# EAGLE design NeuroDAC_Output_v1 (EAGLE 8.1.0)
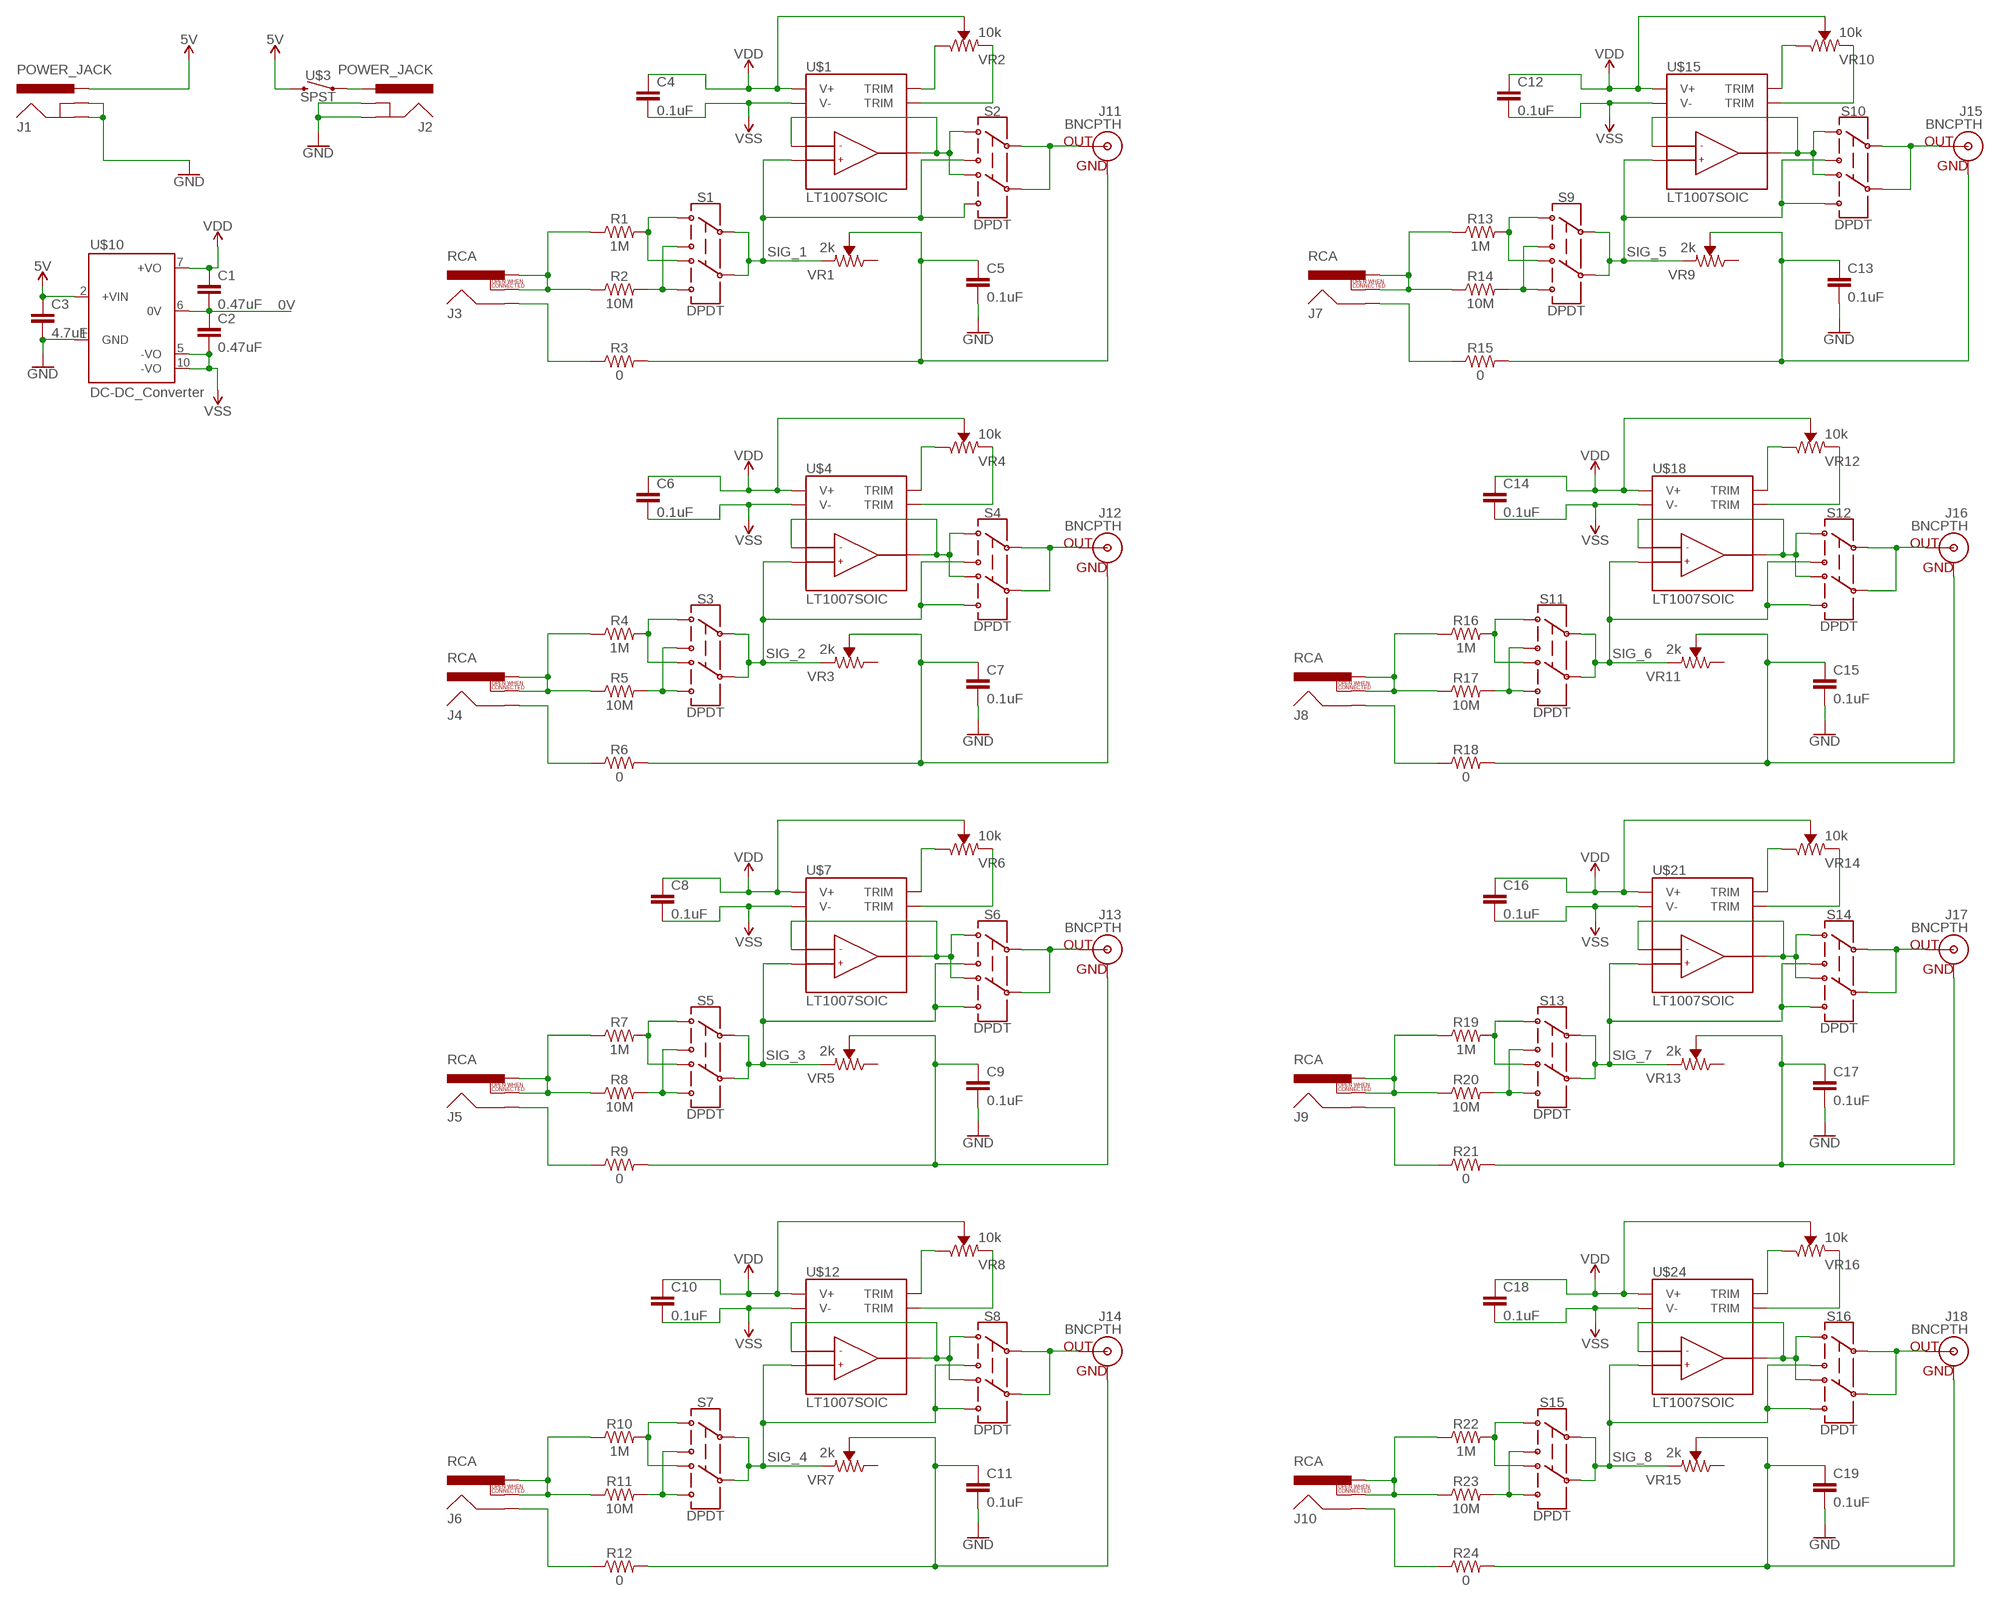
[diagram p0: schematic, sheet 1]

## Parts
C1  0.47uF  470NF-0603-25V-5%  [0603]
C2  0.47uF  470NF-0603-25V-5%  [0603]
C3  4.7uF  4.7UF-0805-25V-10%  [0805]
C4  0.1uF  0.1UF-0603-25V-5%  [0603]
C5  0.1uF  0.1UF-0603-25V-5%  [0603]
C6  0.1uF  0.1UF-0603-25V-5%  [0603]
C7  0.1uF  0.1UF-0603-25V-5%  [0603]
C8  0.1uF  0.1UF-0603-25V-5%  [0603]
C9  0.1uF  0.1UF-0603-25V-5%  [0603]
C10  0.1uF  0.1UF-0603-25V-5%  [0603]
C11  0.1uF  0.1UF-0603-25V-5%  [0603]
C12  0.1uF  0.1UF-0603-25V-5%  [0603]
C13  0.1uF  0.1UF-0603-25V-5%  [0603]
C14  0.1uF  0.1UF-0603-25V-5%  [0603]
C15  0.1uF  0.1UF-0603-25V-5%  [0603]
C16  0.1uF  0.1UF-0603-25V-5%  [0603]
C17  0.1uF  0.1UF-0603-25V-5%  [0603]
C18  0.1uF  0.1UF-0603-25V-5%  [0603]
C19  0.1uF  0.1UF-0603-25V-5%  [0603]
J1  POWER_JACK  [POWER_JACK_PTH]
J2  POWER_JACK  [POWER_JACK_PTH]
J3  RCA  RCASWITCHCRAFT_LARGEHOLE  [RCA_LARGE_HOLE]
J4  RCA  RCASWITCHCRAFT_LARGEHOLE  [RCA_LARGE_HOLE]
J5  RCA  RCASWITCHCRAFT_LARGEHOLE  [RCA_LARGE_HOLE]
J6  RCA  RCASWITCHCRAFT_LARGEHOLE  [RCA_LARGE_HOLE]
J7  RCA  RCASWITCHCRAFT_LARGEHOLE  [RCA_LARGE_HOLE]
J8  RCA  RCASWITCHCRAFT_LARGEHOLE  [RCA_LARGE_HOLE]
J9  RCA  RCASWITCHCRAFT_LARGEHOLE  [RCA_LARGE_HOLE]
J10  RCA  RCASWITCHCRAFT_LARGEHOLE  [RCA_LARGE_HOLE]
J11  BNCPTH  [BNC]
J12  BNCPTH  [BNC]
J13  BNCPTH  [BNC]
J14  BNCPTH  [BNC]
J15  BNCPTH  [BNC]
J16  BNCPTH  [BNC]
J17  BNCPTH  [BNC]
J18  BNCPTH  [BNC]
R1  1M  1MOHM-0603-1/4W-1%  [0603]
R2  10M  10MOHM-0603-1/4W-1%  [0603]
R3  0  0OHM-0603-1/4W  [0603]
R4  1M  1MOHM-0603-1/4W-1%  [0603]
R5  10M  10MOHM-0603-1/4W-1%  [0603]
R6  0  0OHM-0603-1/4W  [0603]
R7  1M  1MOHM-0603-1/4W-1%  [0603]
R8  10M  10MOHM-0603-1/4W-1%  [0603]
R9  0  0OHM-0603-1/4W  [0603]
R10  1M  1MOHM-0603-1/4W-1%  [0603]
R11  10M  10MOHM-0603-1/4W-1%  [0603]
R12  0  0OHM-0603-1/4W  [0603]
R13  1M  1MOHM-0603-1/4W-1%  [0603]
R14  10M  10MOHM-0603-1/4W-1%  [0603]
R15  0  0OHM-0603-1/4W  [0603]
R16  1M  1MOHM-0603-1/4W-1%  [0603]
R17  10M  10MOHM-0603-1/4W-1%  [0603]
R18  0  0OHM-0603-1/4W  [0603]
R19  1M  1MOHM-0603-1/4W-1%  [0603]
R20  10M  10MOHM-0603-1/4W-1%  [0603]
R21  0  0OHM-0603-1/4W  [0603]
R22  1M  1MOHM-0603-1/4W-1%  [0603]
R23  10M  10MOHM-0603-1/4W-1%  [0603]
R24  0  0OHM-0603-1/4W  [0603]
S1  DPDT  SWITCH-DPDT-SMD-JS202011SCQN  [SWITCH_DPDT_JS202011SCQN]
S2  DPDT  SWITCH-DPDT-SMD-JS202011SCQN  [SWITCH_DPDT_JS202011SCQN]
S3  DPDT  SWITCH-DPDT-SMD-JS202011SCQN  [SWITCH_DPDT_JS202011SCQN]
S4  DPDT  SWITCH-DPDT-SMD-JS202011SCQN  [SWITCH_DPDT_JS202011SCQN]
S5  DPDT  SWITCH-DPDT-SMD-JS202011SCQN  [SWITCH_DPDT_JS202011SCQN]
S6  DPDT  SWITCH-DPDT-SMD-JS202011SCQN  [SWITCH_DPDT_JS202011SCQN]
S7  DPDT  SWITCH-DPDT-SMD-JS202011SCQN  [SWITCH_DPDT_JS202011SCQN]
S8  DPDT  SWITCH-DPDT-SMD-JS202011SCQN  [SWITCH_DPDT_JS202011SCQN]
S9  DPDT  SWITCH-DPDT-SMD-JS202011SCQN  [SWITCH_DPDT_JS202011SCQN]
S10  DPDT  SWITCH-DPDT-SMD-JS202011SCQN  [SWITCH_DPDT_JS202011SCQN]
S11  DPDT  SWITCH-DPDT-SMD-JS202011SCQN  [SWITCH_DPDT_JS202011SCQN]
S12  DPDT  SWITCH-DPDT-SMD-JS202011SCQN  [SWITCH_DPDT_JS202011SCQN]
S13  DPDT  SWITCH-DPDT-SMD-JS202011SCQN  [SWITCH_DPDT_JS202011SCQN]
S14  DPDT  SWITCH-DPDT-SMD-JS202011SCQN  [SWITCH_DPDT_JS202011SCQN]
S15  DPDT  SWITCH-DPDT-SMD-JS202011SCQN  [SWITCH_DPDT_JS202011SCQN]
S16  DPDT  SWITCH-DPDT-SMD-JS202011SCQN  [SWITCH_DPDT_JS202011SCQN]
U$1  LT1007SOIC  [S8]
U$3  SPST  SWITCH-SPST-L101011MS02Q  [SWITCH_SPST_L101011MS02Q]
U$4  LT1007SOIC  [S8]
U$7  LT1007SOIC  [S8]
U$10  DC-DC_Converter  DC-DC-CONVERTER_DUALOUT-VAT2-S5-D15-SMT  [VAT2-SMT]
U$12  LT1007SOIC  [S8]
U$15  LT1007SOIC  [S8]
U$18  LT1007SOIC  [S8]
U$21  LT1007SOIC  [S8]
U$24  LT1007SOIC  [S8]
VR1  2k  TRIMPOT-SMD-ST-4EB  [TRIMPOT-SMD-ST4EB]
VR2  10k  TRIMPOT-SMD-ST-4EB  [TRIMPOT-SMD-ST4EB]
VR3  2k  TRIMPOT-SMD-ST-4EB  [TRIMPOT-SMD-ST4EB]
VR4  10k  TRIMPOT-SMD-ST-4EB  [TRIMPOT-SMD-ST4EB]
VR5  2k  TRIMPOT-SMD-ST-4EB  [TRIMPOT-SMD-ST4EB]
VR6  10k  TRIMPOT-SMD-ST-4EB  [TRIMPOT-SMD-ST4EB]
VR7  2k  TRIMPOT-SMD-ST-4EB  [TRIMPOT-SMD-ST4EB]
VR8  10k  TRIMPOT-SMD-ST-4EB  [TRIMPOT-SMD-ST4EB]
VR9  2k  TRIMPOT-SMD-ST-4EB  [TRIMPOT-SMD-ST4EB]
VR10  10k  TRIMPOT-SMD-ST-4EB  [TRIMPOT-SMD-ST4EB]
VR11  2k  TRIMPOT-SMD-ST-4EB  [TRIMPOT-SMD-ST4EB]
VR12  10k  TRIMPOT-SMD-ST-4EB  [TRIMPOT-SMD-ST4EB]
VR13  2k  TRIMPOT-SMD-ST-4EB  [TRIMPOT-SMD-ST4EB]
VR14  10k  TRIMPOT-SMD-ST-4EB  [TRIMPOT-SMD-ST4EB]
VR15  2k  TRIMPOT-SMD-ST-4EB  [TRIMPOT-SMD-ST4EB]
VR16  10k  TRIMPOT-SMD-ST-4EB  [TRIMPOT-SMD-ST4EB]

## Nets
0V: C1.2 C2.1 C5.1 C7.1 C9.1 C11.1 C13.1 C15.1 C17.1 C19.1 J11.GND J12.GND J13.GND J14.GND J15.GND J16.GND J17.GND J18.GND R3.2 R6.2 R9.2 R12.2 R15.2 R18.2 R21.2 R24.2 U$10.6(0V) VR1.2(WIPER) VR3.2(WIPER) VR5.2(WIPER) VR7.2(WIPER) VR9.2(WIPER) VR11.2(WIPER) VR13.2(WIPER) VR15.2(WIPER)
5V: C3.1 J1.PWR U$3.2 U$10.2(+VIN)
GND: C3.2 C5.2 C7.2 C9.2 C11.2 C13.2 C15.2 C17.2 C19.2 J1.GND J1.GNDBREAK J2.GND J2.GNDBREAK U$10.1(GND)
N$1: J3.PIN J3.SWITCH R1.1 R2.1
N$2: R1.2 S1.1 S1.4
N$3: J2.PWR U$3.1
N$4: R2.2 S1.3 S1.6
N$5: R4.2 S3.1 S3.4
N$6: J3.SHELL R3.1
N$7: U$1.1(TRIM) VR2.3(CW)
N$8: S2.1 S2.4 U$1.2(IN-) U$1.6(OUT)
N$9: U$1.8(TRIM) VR2.1(CCW)
N$10: J4.PIN J4.SWITCH R4.1 R5.1
N$11: R5.2 S3.3 S3.6
N$12: R7.2 S5.1 S5.4
N$13: R8.2 S5.3 S5.6
N$14: J4.SHELL R6.1
N$15: S4.1 S4.4 U$4.2(IN-) U$4.6(OUT)
N$16: U$4.1(TRIM) VR4.3(CW)
N$17: U$4.8(TRIM) VR4.1(CCW)
N$18: J5.PIN J5.SWITCH R7.1 R8.1
N$19: R10.2 S7.1 S7.4
N$20: R11.2 S7.3 S7.6
N$21: R13.2 S9.1 S9.4
N$22: J5.SHELL R9.1
N$23: S6.1 S6.4 U$7.2(IN-) U$7.6(OUT)
N$24: U$7.1(TRIM) VR6.3(CW)
N$25: U$7.8(TRIM) VR6.1(CCW)
N$26: J6.PIN J6.SWITCH R10.1 R11.1
N$27: R14.2 S9.3 S9.6
N$28: R16.2 S11.1 S11.4
N$29: R17.2 S11.3 S11.6
N$30: J6.SHELL R12.1
N$31: S8.1 S8.4 U$12.2(IN-) U$12.6(OUT)
N$32: U$12.1(TRIM) VR8.3(CW)
N$33: U$12.8(TRIM) VR8.1(CCW)
N$34: J7.PIN J7.SWITCH R13.1 R14.1
N$35: R19.2 S13.1 S13.4
N$36: R20.2 S13.3 S13.6
N$37: R22.2 S15.1 S15.4
N$38: J7.SHELL R15.1
N$39: S10.1 S10.4 U$15.2(IN-) U$15.6(OUT)
N$40: U$24.1(TRIM) VR16.3(CW)
N$41: U$15.8(TRIM) VR10.1(CCW)
N$42: J8.PIN J8.SWITCH R16.1 R17.1
N$43: R23.2 S15.3 S15.6
N$44: J11.S(OUT) S2.2 S2.5
N$45: J12.S(OUT) S4.2 S4.5
N$46: J8.SHELL R18.1
N$47: S12.1 S12.4 U$18.2(IN-) U$18.6(OUT)
N$48: U$21.1(TRIM) VR14.3(CW)
N$49: U$18.8(TRIM) VR12.1(CCW)
N$50: J9.PIN J9.SWITCH R19.1 R20.1
N$51: J13.S(OUT) S6.2 S6.5
N$52: J14.S(OUT) S8.2 S8.5
N$53: J15.S(OUT) S10.2 S10.5
N$54: J9.SHELL R21.1
N$55: S14.1 S14.4 U$21.2(IN-) U$21.6(OUT)
N$56: U$18.1(TRIM) VR12.3(CW)
N$57: U$21.8(TRIM) VR14.1(CCW)
N$58: J10.PIN J10.SWITCH R22.1 R23.1
N$59: J16.S(OUT) S12.2 S12.5
N$60: J17.S(OUT) S14.2 S14.5
N$61: J18.S(OUT) S16.2 S16.5
N$62: J10.SHELL R24.1
N$63: S16.1 S16.4 U$24.2(IN-) U$24.6(OUT)
N$64: U$15.1(TRIM) VR10.3(CW)
N$65: U$24.8(TRIM) VR16.1(CCW)
SIG_1: S1.2 S1.5 S2.3 S2.6 U$1.3(IN+) VR1.1(CCW)
SIG_2: S3.2 S3.5 S4.3 S4.6 U$4.3(IN+) VR3.1(CCW)
SIG_3: S5.2 S5.5 S6.3 S6.6 U$7.3(IN+) VR5.1(CCW)
SIG_4: S7.2 S7.5 S8.3 S8.6 U$12.3(IN+) VR7.1(CCW)
SIG_5: S9.2 S9.5 S10.3 S10.6 U$15.3(IN+) VR9.1(CCW)
SIG_6: S11.2 S11.5 S12.3 S12.6 U$18.3(IN+) VR11.1(CCW)
SIG_7: S13.2 S13.5 S14.3 S14.6 U$21.3(IN+) VR13.1(CCW)
SIG_8: S15.2 S15.5 S16.3 S16.6 U$24.3(IN+) VR15.1(CCW)
VDD: C1.1 C4.1 C6.1 C8.1 C10.1 C12.1 C14.1 C16.1 C18.1 U$1.7(V+) U$4.7(V+) U$7.7(V+) U$10.7(+VO) U$12.7(V+) U$15.7(V+) U$18.7(V+) U$21.7(V+) U$24.7(V+) VR2.2(WIPER) VR4.2(WIPER) VR6.2(WIPER) VR8.2(WIPER) VR10.2(WIPER) VR12.2(WIPER) VR14.2(WIPER) VR16.2(WIPER)
VSS: C2.2 C4.2 C6.2 C8.2 C10.2 C12.2 C14.2 C16.2 C18.2 U$1.4(V-) U$4.4(V-) U$7.4(V-) U$10.5(-VO) U$10.10(-VO) U$12.4(V-) U$15.4(V-) U$18.4(V-) U$21.4(V-) U$24.4(V-)
Unconnected: VR1.3(CW) VR3.3(CW) VR5.3(CW) VR7.3(CW) VR9.3(CW) VR11.3(CW) VR13.3(CW) VR15.3(CW)

## Library data of the parts
C1 C2 = SparkFun-Capacitors:470NF: 0.47uF/470nF ceramic capacitors A capacitor is a passive two-terminal electrical component used to store electrical energy temporarily in an electric field.
C3 = SparkFun-Capacitors:4.7UF: 4.7µF ceramic capacitors A capacitor is a passive two-terminal electrical component used to store electrical energy temporarily in an electric field.
C4-C19 = SparkFun-Capacitors:0.1UF: 0.1µF ceramic capacitors A capacitor is a passive two-terminal electrical component used to store electrical energy temporarily in an electric field.; PROD_ID: CAP-08604
J1 J2 = SparkFun-Connectors:POWER_JACK: Power Jack Connector This is the standard 5.5mm barrel jack for power. The PTH is the most common, proven, reliable, footprint. The Slot footprint only works if the mill layer is transmitted to the PCB fab house so be warned. Here are the connectors we sell at SparkFun: DC Barrel Power Jack/Connector <https://www.sparkfun.com/products/119> (PRT-00119) DC Barrel Power Jack/Connector (SMD) <https://www.sparkfun.com/products/12748> (PRT-12748) DC Barrel Jack Adapter - Breadboard Compatible <https://www.sparkfun.com/products/10811> (PRT-10811) It is used on this SparkFun product (and many, many others): SparkFun RedBoard - Programmed with Arduino <https://www.sparkfun.com/products/12757> (DEV-12757) Also, if you need a mating power supply or connector, please check these out: Wall Adapter Power Supply - 9VDC 650mA <https://www.sparkfun.com/products/298> (TOL-00298) DC Barrel Jack Adapter - Male <https://www.sparkfun.com/products/10287> (PRT-10287); PROD_ID: CONN-08197
J3-J10 = SparkFun-Connectors:RCA: RCA Jack connector This is a right angle RCA jack connecotr. Commonly used for video or audio. Here is the connector we sell at SparkFun: RCA Jack <https://www.sparkfun.com/products/8631> (PRT-08631) Datasheet <http://www.sparkfun.com/datasheets/Prototyping/Connectors/RCA-Jack.pdf> It is not used on any active designs, however it was used on a couple retired products: RCA Jack Breakout [RETIRED] <https://www.sparkfun.com/products/8826> (PRT-08826) SparkFun On Screen Display Breakout - MAX7456 [RETIRED] <https://www.sparkfun.com/products/9168> (BOB-09168) You may also be interested in a cable: RCA Video Cable - 6' <https://www.sparkfun.com/products/11573> (CAB-11573)
J11-J18 = SparkFun-Connectors:BNC: BNC Right Angle Connector Mouser Part# 5227161 SparkFun Products: BNC Connector - Right Angle <https://www.sparkfun.com/products/10550>; PROD_ID: LPA-12729; SF_ID: PRT-10550
R1 R4 R7 R10 R13 R16 R19 R22 = SparkFun-Resistors:1MOHM: 1MΩ resistor A resistor is a passive two-terminal electrical component that implements electrical resistance as a circuit element. Resistors act to reduce current flow, and, at the same time, act to lower voltage levels within circuits. - Wikipedia
R2 R5 R8 R11 R14 R17 R20 R23 = SparkFun-Resistors:10MOHM: RES-09327
R3 R6 R9 R12 R15 R18 R21 R24 = SparkFun-Resistors:0OHM: 0Ω resistor A resistor is a passive two-terminal electrical component that implements electrical resistance as a circuit element. Resistors act to reduce current flow, and, at the same time, act to lower voltage levels within circuits. - Wikipedia
S1-S16 = SparkFun-Switches:SWITCH-DPDT: Double-Pole, Double-Throw (DPDT) Switch Double-pole, double-throw switches. Variant Overview PTH-GPI-152-3013 Used on SparkFun Geiger Counter <https://www.sparkfun.com/products/11345> SMD-AY0202 Surface Mount DPDT Switch <https://www.sparkfun.com/products/597> (COM-00597) Used on e.g. LilyPad Arduino USB - ATmega32U4 Board <https://www.sparkfun.com/products/12049>
U$1 U$4 U$7 U$12 U$15 U$18 U$21 U$24 = SparkFun-IC-Amplifiers:LT1007: LT1007 device. This is a very low noise OpAmp. Projects used in: NeuroDAC - Buffer
U$3 = SparkFun-Switches:SWITCH-SPST: SPST sliding switches.
U$10 = SparkFun-IC-Power:DC-DC-CONVERTER_DUALOUT: DC-DC converter from CUI Inc.
VR1-VR16 = SparkFun-Resistors:TRIMPOT: Trimming Potentiometer (Trimpot) Three-terminal potentiometers, with an adjustable wiper and two adjustable resistors. A pot can be used to create a configurable voltage divider, or as a variable resistor. "Trimpots" are a subset of potentiometers, usually intended for "set-and-forget" applications. They're often more delicate than standard potentiometers - rated for fewer turns. Variants PTH-KNOB - PTH Trimpot w/ finger-adjustable knob Trimpot 10K with Knob <https://www.sparkfun.com/products/9806> (COM-09806) Datasheet <http://www.sparkfun.com/datasheets/Components/General/TSR-3386.pdf> SMD-3MM-CLOSED-FRAME - SMD 3mm Square Closed-Frame Trimpot Used on e.g. EasyDriver - Stepper Motor Driver <https://www.sparkfun.com/products/12779> Datasheet <http://www.bitechnologies.com/pdfs/22.pdf> (22AR10KTR) SMD-5MM - SMD 5mm Square Closed-Frame Trimpot Used on e.g. IOIO-OTG - V2.2 <https://www.sparkfun.com/products/13613> Datasheet <http://www.vishay.com/docs/51008/ts53.pdf> (TS53YL502MR10) SMD-3MM-1/10W-25% - 3mm Square Open-Frame Trimpot Used on e.g. SparkFun Shapeoko <https://www.sparkfun.com/products/13899> Datasheet <http://www.bourns.com/docs/Product-Datasheets/TC33.pdf> (TC33X-2-103E); VALUE: TRIMPOT

## Board
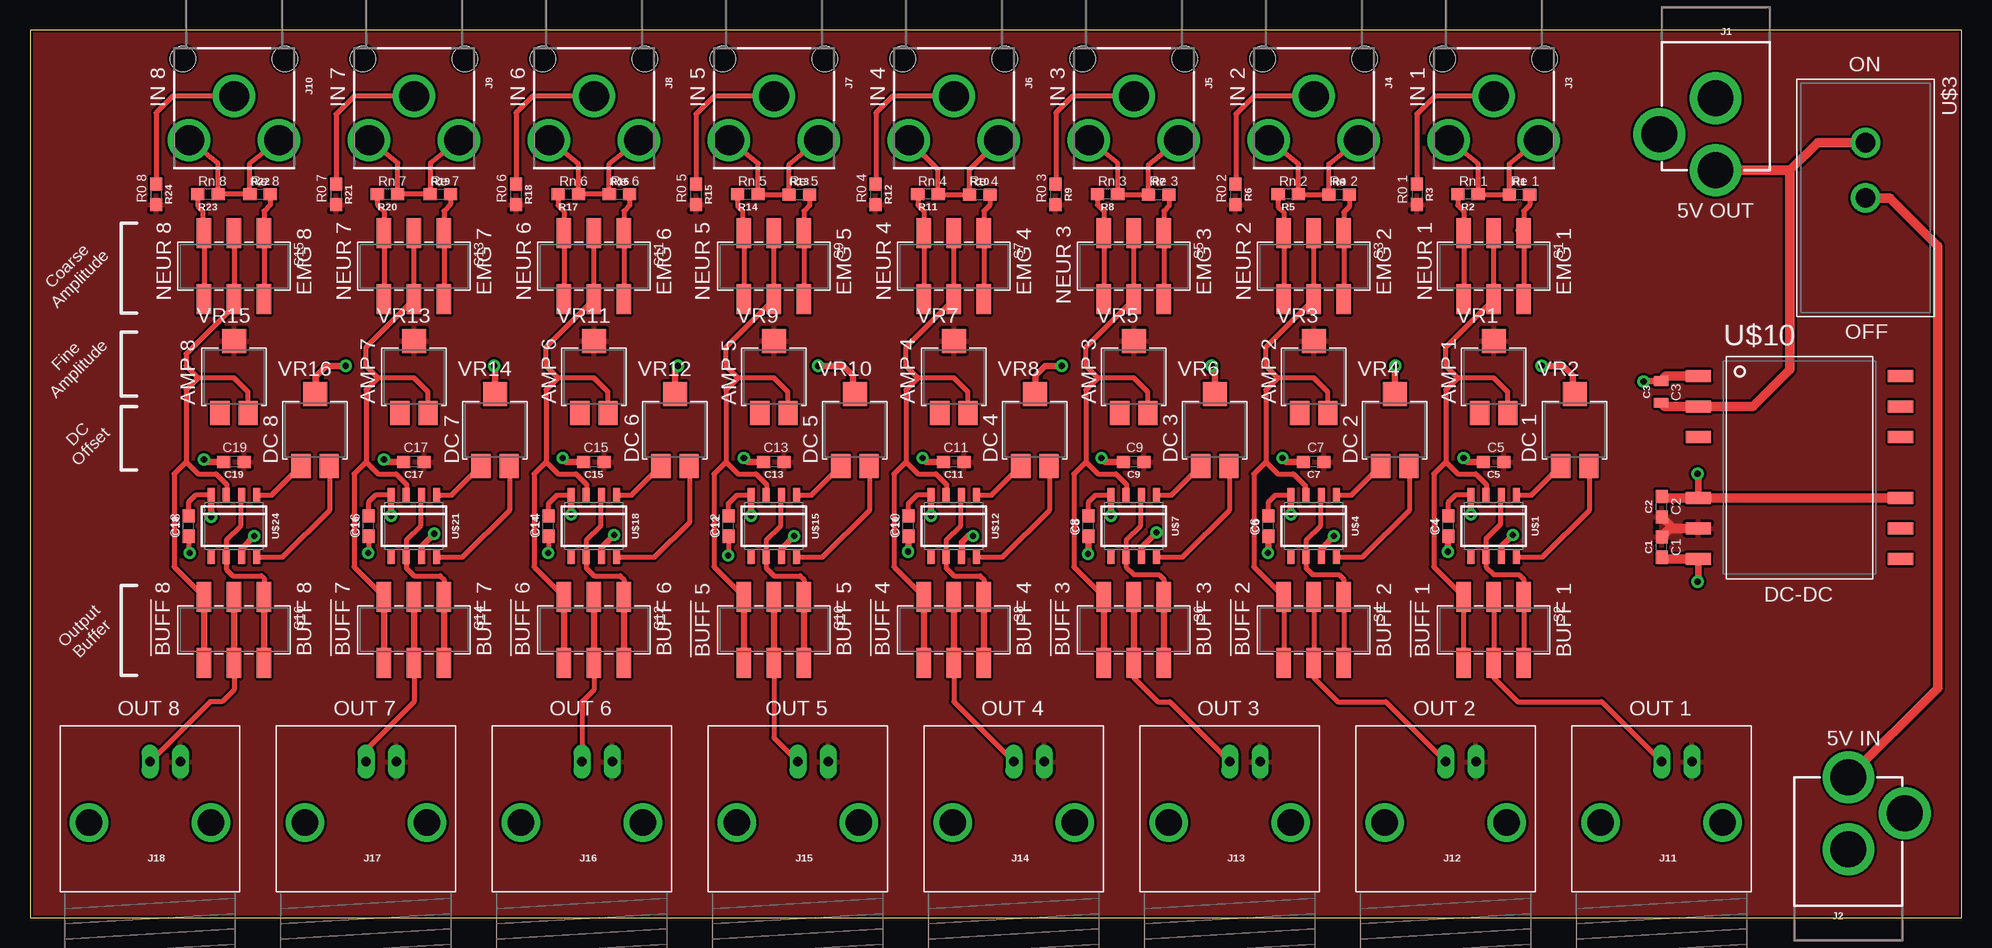
[diagram p1: board, top side]
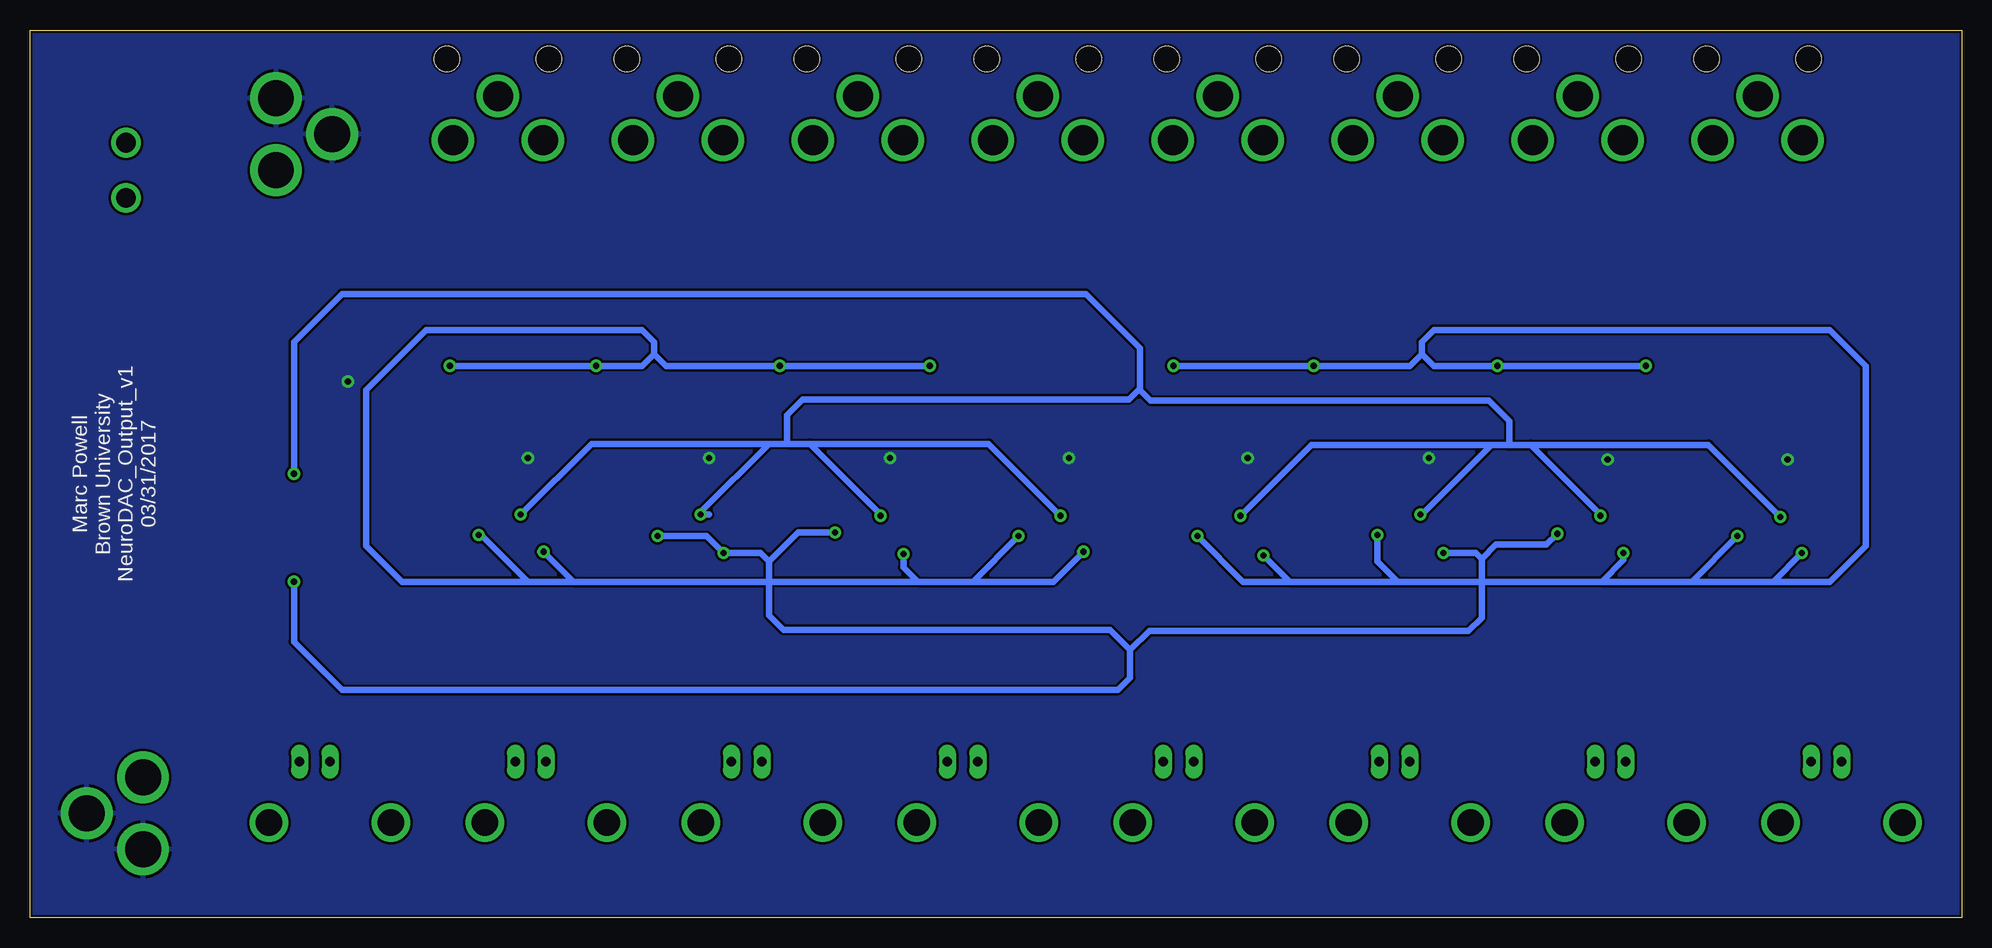
[diagram p2: board, bottom side, seen from below]

Size 161 x 74 mm. Coordinates in mm from the lower left corner, seen from the top.
Outline: 161,74 0,74 0,0 161,0 161,74
Copper layers (1*16): Top 0.035mm / dielectric 1.5mm / Bottom 0.035mm
Design rules "SparkFun": minimum track width 8mil, minimum drill 20mil, track to track 8mil, track to pad 8mil, pad to pad 8mil, via to via 8mil, smd to smd 8mil, copper to edge 8mil, drill to drill 8mil, minimum pad ring 12mil, minimum via ring 10mil, stop-mask expansion 4mil, vias tented up to drill 20mil, thermal gap 10mil

### Footprints (pad centres in the part's own frame; a part is rotated, then mirrored left to right if it is on the bottom)
0603 = smd 1.1 x 1: 1 -0.85,0; 2 0.85,0
0805 = smd 0.8 x 1.2: 1 -0.9,0; 2 0.9,0
POWER_JACK_PTH = drill 2.997 pad 4.318: GND 0,7.7; GNDBREAK 4.7,10.7; PWR 0,13.7
RCA_LARGE_HOLE = drill 2.5: PIN 3.7,3.75; SHELL 0,0; SWITCH 3.7,-3.75 | hole 2.1: -3.1,4.25; -3.1,-4.25
BNC = drill 2.2: 3 -5.08,5.08; 4 5.08,5.08 | drill 0.8 long: GND -2.54,0; S 0,0
SWITCH_DPDT_JS202011SCQN = smd 1.2 x 2.5: 1 -2.5,-2.75; 2 0,-2.75; 3 2.5,-2.75; 4 -2.5,2.75; 5 0,2.75; 6 2.5,2.75
S8 = smd 0.6 x 1.2: 1 -1.905,-2.578; 2 -0.635,-2.578; 3 0.635,-2.578; 4 1.905,-2.578; 5 1.905,2.578; 6 0.635,2.578; 7 -0.635,2.578; 8 -1.905,2.578
SWITCH_SPST_L101011MS02Q = drill 1.65: 1 0,0; 2 -4.6,0
VAT2-SMT = smd 0.991 x 2.108: 1 -7.62,-8.433; 2 -5.08,-8.433; 3 -2.54,-8.433; 5 2.54,-8.433; 6 5.08,-8.433; 7 7.62,-8.433; 8 7.62,8.433; 9 5.08,8.433; 10 2.54,8.433; 12 -2.54,8.433; 13 -5.08,8.433; 14 -7.62,8.433
TRIMPOT-SMD-ST4EB = smd 1.6 x 2: 1 1.175,-3; 3 -1.175,-3 | smd 2 x 2: 2 0,3

### Placement (x,y rotation side)
C1  136,30.89 90 top
C2  136,34.25 90 top
C3  135.96,43.83 90 top
C4  118.21,32.64 90 top
C5  122,38 180 top
C6  103.21,32.64 90 top
C7  107,38 180 top
C8  88.21,32.64 90 top
C9  92,38 180 top
C10  73.21,32.64 90 top
C11  77,38 180 top
C12  58.21,32.64 90 top
C13  62,38 180 top
C14  43.21,32.64 90 top
C15  47,38 180 top
C16  28.21,32.64 90 top
C17  32,38 180 top
C18  13.21,32.64 90 top
C19  17,38 180 top
J1  140.5,76 180 top
J2  151.58,-2 0 top
J3  122,68.5 270 top
J4  107,68.5 270 top
J5  92,68.5 270 top
J6  77,68.5 270 top
J7  62,68.5 270 top
J8  47,68.5 270 top
J9  32,68.5 270 top
J10  17,68.5 270 top
J11  136,13 180 top
J12  118,13 180 top
J13  100,13 180 top
J14  82,13 180 top
J15  64,13 180 top
J16  46,13 180 top
J17  28,13 180 top
J18  10,13 180 top
R1  124.15,60.29 0 top
R2  119.86,60.31 180 top
R3  115.59,60.3 270 top
R4  109.12,60.29 0 top
R5  104.89,60.31 180 top
R6  100.49,60.3 270 top
R7  94.09,60.29 0 top
R8  89.82,60.31 180 top
R9  85.49,60.3 270 top
R10  79.16,60.29 0 top
R11  74.85,60.31 180 top
R12  70.49,60.3 270 top
R13  64.13,60.29 0 top
R14  59.84,60.3 180 top
R15  55.5,60.3 270 top
R16  49.14,60.3 0 top
R17  44.87,60.3 180 top
R18  40.5,60.3 270 top
R19  34.21,60.3 0 top
R20  29.8,60.3 180 top
R21  25.5,60.3 270 top
R22  19.18,60.3 0 top
R23  14.83,60.3 180 top
R24  10.5,60.3 270 top
S1  122,54.3 180 top
S2  122,24 180 top
S3  107,54.3 180 top
S4  107,24 180 top
S5  92,54.3 180 top
S6  92,24 180 top
S7  77,54.3 180 top
S8  77,24 180 top
S9  62,54.3 180 top
S10  62,24 180 top
S11  47,54.3 180 top
S12  47,24 180 top
S13  32,54.3 180 top
S14  32,24 180 top
S15  17,54.3 180 top
S16  17,24 180 top
U$1  122,32.64 180 top
U$3  153,60 270 top
U$4  107,32.64 180 top
U$7  92,32.64 180 top
U$10  147.49,37.52 270 top
U$12  77,32.64 180 top
U$15  62,32.64 180 top
U$18  47,32.64 180 top
U$21  32,32.64 180 top
U$24  17,32.64 180 top
VR1  122,45.07 0 top
VR2  128.75,40.64 0 top
VR3  107,45.07 0 top
VR4  113.75,40.64 0 top
VR5  92,45.07 0 top
VR6  98.75,40.64 0 top
VR7  77,45.07 0 top
VR8  83.75,40.64 0 top
VR9  62,45.07 0 top
VR10  68.75,40.64 0 top
VR11  47,45.07 0 top
VR12  53.75,40.64 0 top
VR13  32,45.07 0 top
VR14  38.75,40.64 0 top
VR15  17,45.07 0 top
VR16  23.75,40.64 0 top

### Tracks (layer width: path | path; a pad name or v marks a point on that pad's centre or on a via)
0V
  Top 0.8: C2.1 136.96,32.44 U$10.6 136.7,32.44 C1.2
  pour Top: 161,74 161,0 0,0 0,74
5V
  Top 0.8: C3.1 136.29,42.6 U$10.2 143.6,42.6 146.7,45.7 146.7,62.3 | J1.PWR 146.7,62.3 | 146.7,62.3 149,64.6 U$3.2
GND  (via drill 0.51)
  Top 0.525: C3.2 134.53,44.73 v134.5,44.7 | C5.2 119.8,38 v119.5,38.3 | C7.2 104.7,38 v104.4,38.3 | C9.2 89.6,38 v89.3,38.3 | C11.2 74.7,38 v74.4,38.3 | C13.2 59.8,38 v59.5,38.3 | C15.2 44.7,38 v44.4,38.3 | C17.2 29.7,38 v29.5,38.2 | C19.2 14.7,38 v14.5,38.2
  Top 0.8: U$10.1 136.37,45.14 C3.2
  pour Bottom: 161,74 161,0 0,0 0,74
N$1
  Top 0.406: J3.PIN 123.3,62.85 R1.1 120.73,60.29 R2.1 120.71,62.84 J3.SWITCH
N$2
  Top 0.406: S1.1 S1.4 | S1.1 124.25,57.05 124,57.3 | R1.2 125,59.4 124.5,58.9 S1.1
N$3
  Top 0.8: U$3.1 155,60 159,56 159,19.12 J2.PWR
N$4
  Top 0.406: S1.6 S1.3 119.5,58.9 119.01,59.39 R2.2
N$5
  Top 0.406: S3.4 S3.1 109.5,58.8 109.97,59.27 R4.2
N$6
  Top 0.406: J3.SHELL 117.1,68.5 115.6,67 R3.1
N$7
  Top 0.406: U$1.1 125.15,35.22 VR2.3
N$8
  Top 0.406: U$1.2 122.6,35.18 122.6,32.8 121.36,31.57 U$1.6 121.36,29.23 122,28.6 124.1,28.6 124.5,28.2 S2.1 S2.4
N$9
  Top 0.406: U$1.8 126.06,30.06 130,34 130,37.56 VR2.1
N$10
  Top 0.406: J4.PIN 108.27,62.82 R4.1 105.76,60.29 R5.1 105.74,62.81 J4.SWITCH
N$11
  Top 0.406: S3.6 S3.3 104.5,58.8 104.04,59.26 R5.2
N$12
  Top 0.406: R7.2 94.94,59.34 94.5,58.9 S5.1 S5.4
N$13
  Top 0.406: R8.2 88.97,59.43 89.5,58.9 S5.3 S5.6
N$14
  Top 0.406: J4.SHELL 102,68.5 100.5,67 R6.1
N$15
  Top 0.406: U$4.2 107.6,35.18 107.6,32.7 106.36,31.46 U$4.6 106.36,29.14 106.9,28.6 109.1,28.6 109.5,28.2 S4.1 S4.4
N$16
  Top 0.406: U$4.1 110.15,35.22 VR4.3
N$17
  Top 0.406: U$4.8 111.06,30.06 115,34 115,37.56 VR4.1
N$18
  Top 0.406: J5.PIN 93.24,62.79 R7.1 90.69,60.29 R8.1 90.67,62.88 J5.SWITCH
N$19
  Top 0.406: R10.2 80.01,59.41 79.5,58.9 S7.1 S7.4
N$20
  Top 0.406: R11.2 74,59.4 74.5,58.9 S7.3 S7.6
N$21
  Top 0.406: R13.2 64.98,59.38 64.5,58.9 S9.1 S9.4
N$22
  Top 0.406: J5.SHELL 86.9,68.5 85.5,67.1 R9.1
N$23
  Top 0.406: U$7.2 92.6,35.18 92.6,32.7 91.36,31.46 U$7.6 91.36,29.23 92,28.6 94.1,28.6 94.5,28.2 S6.1
  Top 0.525: S6.1 S6.4
N$24
  Top 0.406: U$7.1 95.15,35.22 VR6.3
N$25
  Top 0.406: U$7.8 96.06,30.06 100,34 100,37.56 VR6.1
N$26
  Top 0.406: J6.PIN 78.31,62.36 R10.1 75.72,60.29 R11.1 75.7,62.35 J6.SWITCH
N$27
  Top 0.406: R14.2 58.99,59.31 59.4,58.9 59.4,57.15 S9.3 S9.6
N$28
  Top 0.406: R16.2 49.99,59.39 49.5,58.9 S11.1 S11.4
N$29
  Top 0.406: R17.2 44.02,59.38 44.5,58.9 S11.3 S11.6
N$30
  Top 0.406: J6.SHELL 71.9,68.5 70.5,67.1 R12.1
N$31
  Top 0.406: U$12.2 77.6,35.18 77.6,32.7 76.36,31.46 U$12.6 76.36,29.14 77,28.5 79.2,28.5 79.5,28.2 S8.1
  Top 0.525: S8.1 S8.4
N$32
  Top 0.406: U$12.1 80.15,35.22 VR8.3
N$33
  Top 0.406: U$12.8 81.06,30.06 85,34 85,37.56 VR8.1
N$34
  Top 0.406: J7.PIN 63.28,62.83 R13.1 R14.1 60.69,62.86 J7.SWITCH
N$35
  Top 0.406: R19.2 35.06,59.46 34.5,58.9 S13.1 S13.4
N$36
  Top 0.406: R20.2 28.95,59.45 29.5,58.9 S13.3 S13.6
N$37
  Top 0.406: R22.2 20.03,59.43 19.5,58.9 S15.1 S15.4
N$38
  Top 0.406: J7.SHELL 57,68.5 55.5,67 R15.1
N$39
  Top 0.406: U$15.2 62.6,35.18 62.6,32.7 61.37,31.46 U$15.6 61.37,29.14 62,28.5 64.2,28.5 64.5,28.2 S10.1
  Top 0.525: S10.1 S10.4
N$40
  Top 0.406: U$24.1 20.15,35.22 VR16.3
N$41
  Top 0.406: U$15.8 66.06,30.06 70,34 70,37.56 VR10.1
N$42
  Top 0.406: J8.PIN 48.29,62.84 R16.1 R17.1 45.72,62.83 J8.SWITCH
N$43
  Top 0.406: R23.2 13.98,59.32 14.4,58.9 14.4,57.15 S15.3 S15.6
N$44
  Top 0.406: S2.2 S2.5 122,20 124,18 131,18 J11.S
N$45
  Top 0.406: S4.2 S4.5 107,20 109,18 113,18 J12.S
N$46
  Top 0.406: J8.SHELL 41.9,68.5 40.5,67.1 R18.1
N$47
  Top 0.406: U$18.2 47.6,35.18 47.6,32.7 46.37,31.46 U$18.6 46.37,29.14 47,28.5 49.2,28.5 49.5,28.2 S12.1
  Top 0.525: S12.1 S12.4
N$48
  Top 0.406: U$21.1 35.15,35.22 VR14.3
N$49
  Top 0.406: U$18.8 52.06,30.06 55,33 55,37.56 VR12.1
N$50
  Top 0.406: J9.PIN 33.36,62.91 R19.1 R20.1 30.65,62.9 J9.SWITCH
N$51
  Top 0.406: S6.5 92,20 94,18 95,18 J13.S
  Top 0.525: S6.2 S6.5
N$52
  Top 0.406: S8.5 77,18 J14.S
  Top 0.525: S8.2 S8.5
N$53
  Top 0.406: S10.5 62,15 J15.S
  Top 0.525: S10.2 S10.5
N$54
  Top 0.406: J9.SHELL 27,68.5 25.5,67 R21.1
N$55
  Top 0.406: U$21.2 32.6,35.18 32.6,32.7 31.36,31.46 U$21.6 31.36,29.14 32,28.5 34.2,28.5 34.5,28.2 S14.1
  Top 0.525: S14.1 S14.4
N$56
  Top 0.406: U$18.1 50.15,35.22 VR12.3
N$57
  Top 0.406: U$21.8 36.06,30.06 40,34 40,37.56 VR14.1
N$58
  Top 0.406: J10.PIN 18.33,62.88 R22.1 R23.1 15.68,62.87 J10.SWITCH
N$59
  Top 0.406: S12.5 47,19 46,18 J16.S
  Top 0.525: S12.2 S12.5
N$60
  Top 0.406: S14.5 32,18 28,14 J17.S
  Top 0.525: S14.2 S14.5
N$61
  Top 0.406: S16.5 17,19 16,18 15,18 J18.S
  Top 0.525: S16.2 S16.5
N$62
  Top 0.406: J10.SHELL 11.9,68.5 10.5,67.1 R24.1
N$63
  Top 0.406: U$24.2 17.6,35.18 17.6,32.7 16.36,31.46 U$24.6 16.36,29.04 16.9,28.5 19.3,28.5 19.5,28.3 S16.1
  Top 0.525: S16.1 S16.4
N$64
  Top 0.406: U$15.1 65.15,35.22 VR10.3
N$65
  Top 0.406: U$24.8 21.06,30.06 25,34 25,37.56 VR16.1
SIG_1
  Top 0.406: S1.2 S1.5 118,47.55 118,46 119,45 | S2.6 S2.3 117,29.25 117,37 118,38 | 118,38 118,44 119,45 | 118,38 119,37 120.5,37 121.4,36.1 121.4,35.25 U$1.3 | VR1.1 123.17,43.83 122,45 119,45
SIG_2
  Top 0.406: S3.2 S3.5 103,47.55 103,46 104,45 | S4.6 S4.3 102,29.25 102,37 103,38 | 103,38 103,44 104,45 | 103,38 104,37 105.3,37 106.3,36 106.3,35.28 U$4.3 | VR3.1 108.17,43.83 107,45 104,45
SIG_3
  Top 0.406: S5.2 S5.5 88,47.55 88,46 89,45 | 88,38 88,44 89,45 | 88,38 89,37 90.5,37 91.4,36.1 91.4,35.25 U$7.3 | 88,38 87,37 87,29.25 S6.3 | VR5.1 93.17,43.83 92,45 89,45
  Top 0.525: S6.3 S6.6
SIG_4
  Top 0.406: S7.2 S7.5 73,47.55 73,46 74,45 | 73,38 73,44 74,45 | 73,38 74,37 75.5,37 76.4,36.1 76.4,35.25 U$12.3 | 73,38 72,37 72,29.25 S8.3 | VR7.1 78.17,43.83 77,45 74,45
  Top 0.525: S8.3 S8.6
SIG_5
  Top 0.406: S9.2 S9.5 58,47.55 58,46 59,45 | 58,38 58,44 59,45 | 58,38 59,37 60.5,37 61.4,36.1 61.4,35.25 U$15.3 | 58,38 57,37 57,29.25 S10.3 | VR9.1 63.17,43.83 62,45 59,45
  Top 0.525: S10.3 S10.6
SIG_6
  Top 0.406: S11.2 S11.5 43,47.55 43,46 44,45 | 43,38 43,44 44,45 | 43,38 44,37 45.5,37 46.4,36.1 46.4,35.25 U$18.3 | 43,38 42,37 42,29.25 S12.3 | VR11.1 48.17,43.83 47,45 44,45
  Top 0.525: S12.3 S12.6
SIG_7
  Top 0.406: S13.2 S13.5 28,47.55 28,46 29,45 | 28,38 28,44 29,45 | 28,38 29,37 30.5,37 31.4,36.1 31.4,35.25 U$21.3 | 28,38 27,37 27,29.25 S14.3 | VR13.1 33.17,43.83 32,45 29,45
  Top 0.525: S14.3 S14.6
SIG_8
  Top 0.406: S15.2 S15.5 17,51 13,47 13,46 14,45 | 13,38 13,44 14,45 | 13,38 14,37 15.5,37 16.4,36.1 16.4,35.25 U$24.3 | 13,38 12,37 12,29.25 S16.3 | VR15.1 18.18,43.83 17,45 14,45
  Top 0.525: S16.3 S16.6
VDD  (via drill 0.51)
  Top 0.406: C14.1 v43.21,30.41 | C12.1 v58.21,30.21 v58.2,30.2 | C16.1 v28.21,30.41 | C18.1 13.21,30.49
  Top 0.525: U$10.7 139.06,28.06 v139,28 | v78.6,31.8 78.2,31.8 77.7,31.3 77.7,30.13 U$12.7 | U$7.7 92.64,30.84 v93.9,32.1 | C6.1 v103.21,30.41 v103.2,30.4 | U$4.7 107.64,30.73 v108.7,31.8 | v118.2,30.5 C4.1 | U$1.7 122.64,30.93 v123.6,31.9 | C8.1 v88.21,30.31 v88.2,30.3 | C10.1 v73.21,30.51 v73.2,30.5 | U$15.7 62.63,30.73 v63.7,31.8 | v43.21,30.41 v43.2,30.4 | U$18.7 47.63,30.84 v48.7,31.9 | U$24.7 17.64,30.73 v18.7,31.8 | 13.21,30.49 v13.3,30.4 | U$21.7 32.63,30.93 v33.7,32 | v28.21,30.41 v28.2,30.4 | 23.69,43.7 VR16.2 23.8,43.69 23.8,45.1 24.7,46 v26.3,46 | 53.69,43.7 VR12.2 53.75,45.75 v54,46 | 68.71,43.6 VR10.2 68.6,43.79 68.6,45.2 67.8,46 v65.7,46 | 83.71,43.6 VR8.2 83.8,43.69 83.8,45.2 84.6,46 v86,46 | 98.71,43.6 VR6.2 98.75,45.75 v98.5,46 | 113.71,43.6 VR4.2 113.75,45.95 v113.8,46 | 128.71,43.6 VR2.2 128.6,43.79 128.6,45.2 127.8,46 v126,46 | VR14.2 38.75,45.95 v38.7,46
  Top 0.8: U$10.7 136.14,29.9 C1.1
  Bottom 0.525: v139,28 139,23 135,19 70.3,19 69.3,20 69.3,22.3 | 69.3,22.3 71,24 98.2,24 99.4,25.2 99.4,28 | 82.4,28 v78.6,31.8 78.4,32 | v108.7,31.8 104.6,31.8 v103.2,30.4 100.1,30.4 99.4,29.7 | 99.4,28 99.4,29.7 | 87,28 82.4,28 | 87,28 99.4,28 | 99.4,29.7 97,32.1 v93.9,32.1 93.8,32 | 115.7,28 99.4,28 | 115.7,28 v118.2,30.5 118.5,30.5 | v123.6,31.9 123.5,32 119.5,28 119,28 | 88.3,30.3 v88.2,30.3 88.2,29.2 87,28 | 73.5,30.5 v73.2,30.5 75.7,28 82.4,28 | 69.3,22.3 67.7,23.9 41.1,23.9 40,25 40,28 | 56,28 47,28 | 47,28 40,28 | v58.2,30.2 56,28 | 43.4,30.4 v43.2,30.4 40.5,30.4 40,29.9 | 48.6,32 v48.7,31.9 | 40,28 40,29.9 | 30,28 22.5,28 | 30,28 40,28 | 22.5,28 v18.7,31.8 18.5,32 | 13.4,30.4 v13.3,30.4 15.7,28 | 40,29.9 38.8,31.1 34.6,31.1 v33.7,32 | 28.4,30.4 v28.2,30.4 28.2,29.8 30,28 | 115.7,28 119,28 | 56,28 59.9,28 v63.7,31.8 | v48.7,31.9 48.7,29.7 47,28 | 22.5,28 15.7,28 | v48.7,31.9 48.9,31.9 | 15.7,28 11,28 8,31 8,46 11,49 44,49 45,48 45,47 | 45,47 44,46 v38.7,46 v26.3,46 | 45,47 46,46 v54,46 v65.7,46 | 109,47 109,48 110,49 128,49 133,44 133,31 130,28 119,28 | 109,47 110,46 v113.8,46 v126,46 | 109,47 108,46 v98.5,46 v86,46
VSS  (via drill 0.51)
  Top 0.406: U$1.4 118.82,35.22 118.2,34.6 C4.2 | U$4.4 103.82,35.22 103.2,34.6 C6.2 | U$7.4 88.82,35.22 88.2,34.6 C8.2 | U$12.4 73.92,35.22 73.2,34.5 C10.2 | U$15.4 58.92,35.22 58.2,34.5 58.21,34.49 C12.2 | U$18.4 43.92,35.22 43.2,34.5 C14.2 | U$21.4 28.82,35.22 28.2,34.6 C16.2 | U$24.4 13.82,35.22 13.2,34.6 C18.2
  Top 0.525: U$10.5 139.06,36.94 v139,37 | v120.1,33.6 U$1.4 | U$4.4 105.09,34.3 | 105.09,34.3 105.1,34.3 | 105.09,34.3 v105.09,33.6 v105.1,33.6 | v75.1,33.5 U$12.4 | U$7.4 v90.09,33.51 v90.1,33.5 | U$15.4 v60.09,33.51 v60.1,33.5 | U$18.4 v45.09,33.6 v45.1,33.6 | U$21.4 v30.09,33.51 v30.1,33.5 | U$24.4 v15.1,33.41 v15.1,33.4
  Top 0.8: U$10.10 U$10.5 136.12,34.98 C2.2
  Bottom 0.525: 104.4,33.6 v105.1,33.6 105.1,33.8 99.4,39.5 | 68.5,44.1 68.5,47.5 73,52 135,52 139,48 v139,37 | 68.5,44.1 69.4,43.2 96.6,43.2 97.9,41.9 97.9,39.6 97.8,39.5 | 97.8,39.5 96,39.5 | 97.8,39.5 99.4,39.5 | 96,39.5 81.1,39.5 v75.1,33.5 | v90.1,33.5 90.1,33.6 96,39.5 | 99.4,39.5 114.2,39.5 v120.1,33.6 | 68.5,44.1 68.5,44 67.6,43.1 39.4,43.1 37.7,41.4 37.7,39.6 37.9,39.4 | 39.2,39.4 54.2,39.4 v60.1,33.5 | v45.1,33.6 45,33.6 39.2,39.4 | 37.9,39.4 35.9,39.4 | 37.9,39.4 39.2,39.4 | 35.9,39.4 21.1,39.4 v15.1,33.4 | v30.1,33.5 30.1,33.6 35.9,39.4

### Text on the board
tPlace: ON | IN 8 | IN 7 | IN 6 | IN 5 | IN 4 | IN 3 | IN 2 | IN 1 | R0 8 | Rn 8 | Re 8 | R0 7 | Rn 7 | Re 7 | R0 6 | Rn 6 | Re 6 | R0 5 | Rn 5 | Re 5 | R0 4 | Rn 4 | Re 4 | R0 3 | Rn 3 | Re 3 | R0 2 | Rn 2 | Re 2 | R0 1 | Rn 1 | Re 1 | 5V OUT | NEUR 8 | EMG 8 | NEUR 7 | EMG 7 | NEUR 6 | EMG 6 | NEUR 5 | EMG 5 | NEUR 4 | EMG 4 | NEUR 3 | EMG 3 | NEUR 2 | EMG 2 | NEUR 1 | EMG 1 | Coarse / Amplitude | OFF | AMP 8 | AMP 7 | AMP 6 | AMP 5 | AMP 4 | AMP 3 | AMP 2 | AMP 1 | Fine / Amplitude | C3 | DC 8 | DC 7 | DC 6 | DC 5 | DC 4 | DC 3 | DC 2 | DC 1 | DC / Offset | C19 | C17 | C15 | C13 | C11 | C9 | C7 | C5 | C2 | C18 | C16 | C14 | C12 | C10 | C8 | C6 | C4 | C1 | !BUFF! 8 | BUFF 8 | !BUFF! 7 | BUFF 7 | !BUFF! 6 | BUFF 6 | !BUFF! 5 | BUFF 5 | !BUFF! 4 | BUFF 4 | !BUFF! 3 | BUFF 3 | !BUFF! 2 | BUFF 2 | !BUFF! 1 | BUFF 1 | DC-DC | Output / Buffer | OUT 8 | OUT 7 | OUT 6 | OUT 5 | OUT 4 | OUT 3 | OUT 2 | OUT 1 | 5V IN
bPlace: Marc Powell / Brown University / NeuroDAC_Output_v1 / 03/31/2017